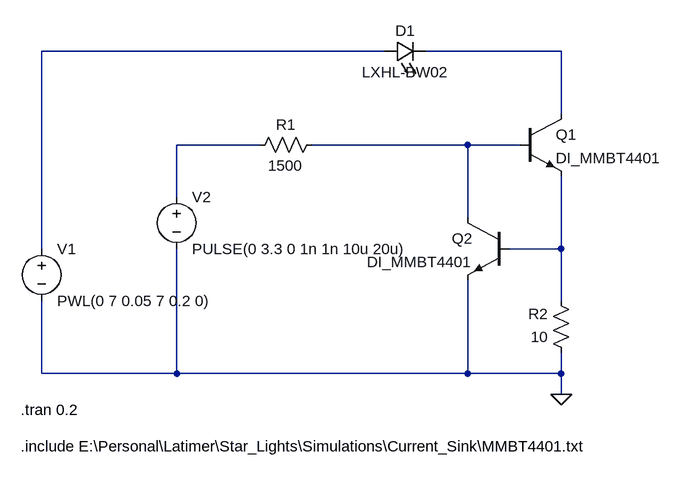
[diagram p0: schematic LED_Driver.asc]
LED_Driver.asc, the LTspice schematic file:
Version 4
SHEET 1 880 768
WIRE 208 144 -320 144
WIRE 480 144 272 144
WIRE 480 240 480 144
WIRE 16 288 -112 288
WIRE 336 288 96 288
WIRE 416 288 336 288
WIRE -112 368 -112 288
WIRE 336 400 336 288
WIRE -320 448 -320 144
WIRE 480 448 480 336
WIRE 480 448 400 448
WIRE 480 528 480 448
WIRE -320 640 -320 528
WIRE -112 640 -112 448
WIRE -112 640 -320 640
WIRE 336 640 336 496
WIRE 336 640 -112 640
WIRE 480 640 480 608
WIRE 480 640 336 640
WIRE 480 672 480 640
FLAG 480 672 0
SYMBOL LED 208 160 R270
WINDOW 0 32 32 VTop 2
WINDOW 3 0 32 VBottom 2
SYMATTR InstName D1
SYMATTR Value LXHL-BW02
SYMATTR Description Diode
SYMATTR Type diode
SYMBOL npn 416 240 R0
SYMATTR InstName Q1
SYMATTR Value DI_MMBT4401
SYMBOL npn 400 400 M0
SYMATTR InstName Q2
SYMATTR Value DI_MMBT4401
SYMBOL res 112 272 R90
WINDOW 0 0 56 VBottom 2
WINDOW 3 32 56 VTop 2
SYMATTR InstName R1
SYMATTR Value 1500
SYMBOL res 496 624 R180
WINDOW 0 36 76 Left 2
WINDOW 3 36 40 Left 2
SYMATTR InstName R2
SYMATTR Value 10
SYMBOL voltage -320 432 R0
WINDOW 123 0 0 Left 2
WINDOW 39 0 0 Left 2
SYMATTR InstName V1
SYMATTR Value PWL(0 7 0.05 7 0.2 0)
SYMBOL voltage -112 352 R0
WINDOW 123 0 0 Left 2
WINDOW 39 0 0 Left 2
SYMATTR InstName V2
SYMATTR Value PULSE(0 3.3 0 1n 1n 10u 20u)
TEXT -352 696 Left 2 !.tran 0.2
TEXT -352 752 Left 2 !.include E:\\Personal\\Latimer\\Star_Lights\\Simulations\\Current_Sink\\MMBT4401.txt

The netlist it stands for:
* LED_Driver.asc
D1 N001 N002 LXHL-BW02
Q1 N002 N004 N005 0 DI_MMBT4401
Q2 N004 N005 0 0 DI_MMBT4401
R1 N004 N003 1500
R2 0 N005 10
V1 N001 0 PWL(0 7 0.05 7 0.2 0)
V2 N003 0 PULSE(0 3.3 0 1n 1n 10u 20u)
.model D D
.lib standard.dio
.model NPN NPN
.model PNP PNP
.lib standard.bjt
.tran 0.2
.include E:\Personal\Latimer\Star_Lights\Simulations\Current_Sink\MMBT4401.txt
.backanno
.end